# EAGLE design Backplane (EAGLE 7.4.0)

## Sheet 1 of 2
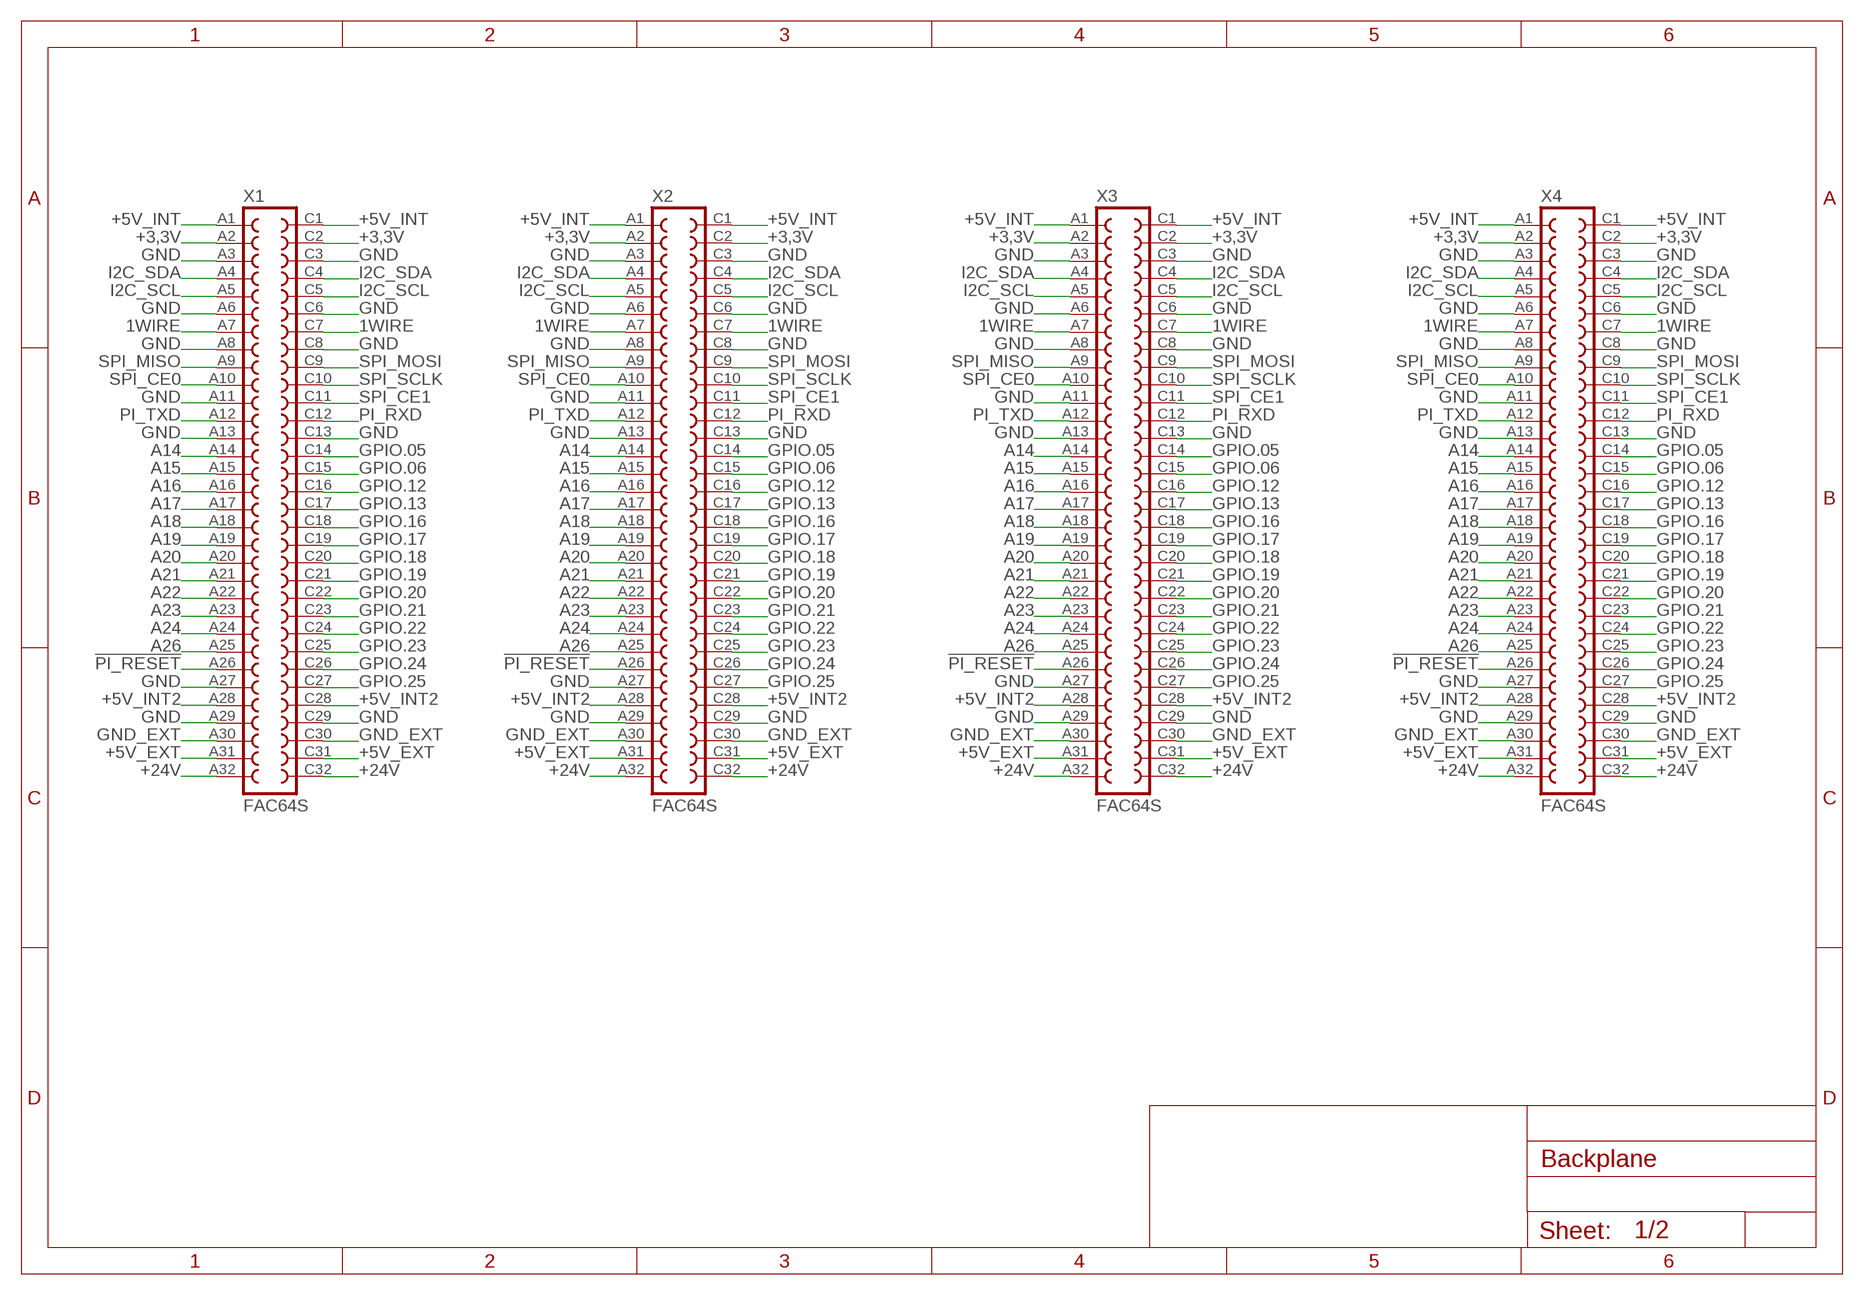
[diagram p0: schematic, sheet 1]

### Parts
X1  FAC64S  [FAC64S]
X2  FAC64S  [FAC64S]
X3  FAC64S  [FAC64S]
X4  FAC64S  [FAC64S]

### Nets
1WIRE: X1.A7 X1.C7 X2.A7 X2.C7 X3.A7 X3.C7 X4.A7 X4.C7 ; also sheet 2
!PI_RESET: X1.A26 X2.A26 X3.A26 X4.A26 ; also sheet 2
+3,3V: X1.A2 X1.C2 X2.A2 X2.C2 X3.A2 X3.C2 X4.A2 X4.C2 ; also sheet 2
+5V_EXT: X1.A31 X1.C31 X2.A31 X2.C31 X3.A31 X3.C31 X4.A31 X4.C31 ; also sheet 2
+5V_INT: X1.A1 X1.C1 X2.A1 X2.C1 X3.A1 X3.C1 X4.A1 X4.C1 ; also sheet 2
+5V_INT2: X1.A28 X1.C28 X2.A28 X2.C28 X3.A28 X3.C28 X4.A28 X4.C28 ; also sheet 2
+24V: X1.A32 X1.C32 X2.A32 X2.C32 X3.A32 X3.C32 X4.A32 X4.C32 ; also sheet 2
A14: X1.A14 X2.A14 X3.A14 X4.A14 ; also sheet 2
A15: X1.A15 X2.A15 X3.A15 X4.A15 ; also sheet 2
A16: X1.A16 X2.A16 X3.A16 X4.A16 ; also sheet 2
A17: X1.A17 X2.A17 X3.A17 X4.A17 ; also sheet 2
A18: X1.A18 X2.A18 X3.A18 X4.A18 ; also sheet 2
A19: X1.A19 X2.A19 X3.A19 X4.A19 ; also sheet 2
A20: X1.A20 X2.A20 X3.A20 X4.A20 ; also sheet 2
A21: X1.A21 X2.A21 X3.A21 X4.A21 ; also sheet 2
A22: X1.A22 X2.A22 X3.A22 X4.A22 ; also sheet 2
A23: X1.A23 X2.A23 X3.A23 X4.A23 ; also sheet 2
A24: X1.A24 X2.A24 X3.A24 X4.A24 ; also sheet 2
A26: X1.A25 X2.A25 X3.A25 X4.A25 ; also sheet 2
GND: X1.A3 X1.A6 X1.A8 X1.A11 X1.A13 X1.A27 X1.A29 X1.C3 X1.C6 X1.C8 X1.C13 X1.C29 X2.A3 X2.A6 X2.A8 X2.A11 X2.A13 X2.A27 X2.A29 X2.C3 X2.C6 X2.C8 X2.C13 X2.C29 X3.A3 X3.A6 X3.A8 X3.A11 X3.A13 X3.A27 X3.A29 X3.C3 X3.C6 X3.C8 X3.C13 X3.C29 X4.A3 X4.A6 X4.A8 X4.A11 X4.A13 X4.A27 X4.A29 X4.C3 X4.C6 X4.C8 X4.C13 X4.C29 ; also sheet 2
GND_EXT: X1.A30 X1.C30 X2.A30 X2.C30 X3.A30 X3.C30 X4.A30 X4.C30 ; also sheet 2
GPIO.05: X1.C14 X2.C14 X3.C14 X4.C14 ; also sheet 2
GPIO.06: X1.C15 X2.C15 X3.C15 X4.C15 ; also sheet 2
GPIO.12: X1.C16 X2.C16 X3.C16 X4.C16 ; also sheet 2
GPIO.13: X1.C17 X2.C17 X3.C17 X4.C17 ; also sheet 2
GPIO.16: X1.C18 X2.C18 X3.C18 X4.C18 ; also sheet 2
GPIO.17: X1.C19 X2.C19 X3.C19 X4.C19 ; also sheet 2
GPIO.18: X1.C20 X2.C20 X3.C20 X4.C20 ; also sheet 2
GPIO.19: X1.C21 X2.C21 X3.C21 X4.C21 ; also sheet 2
GPIO.20: X1.C22 X2.C22 X3.C22 X4.C22 ; also sheet 2
GPIO.21: X1.C23 X2.C23 X3.C23 X4.C23 ; also sheet 2
GPIO.22: X1.C24 X2.C24 X3.C24 X4.C24 ; also sheet 2
GPIO.23: X1.C25 X2.C25 X3.C25 X4.C25 ; also sheet 2
GPIO.24: X1.C26 X2.C26 X3.C26 X4.C26 ; also sheet 2
GPIO.25: X1.C27 X2.C27 X3.C27 X4.C27 ; also sheet 2
I2C_SCL: X1.A5 X1.C5 X2.A5 X2.C5 X3.A5 X3.C5 X4.A5 X4.C5 ; also sheet 2
I2C_SDA: X1.A4 X1.C4 X2.A4 X2.C4 X3.A4 X3.C4 X4.A4 X4.C4 ; also sheet 2
PI_RXD: X1.C12 X2.C12 X3.C12 X4.C12 ; also sheet 2
PI_TXD: X1.A12 X2.A12 X3.A12 X4.A12 ; also sheet 2
SPI_CE0: X1.A10 X2.A10 X3.A10 X4.A10 ; also sheet 2
SPI_CE1: X1.C11 X2.C11 X3.C11 X4.C11 ; also sheet 2
SPI_MISO: X1.A9 X2.A9 X3.A9 X4.A9 ; also sheet 2
SPI_MOSI: X1.C9 X2.C9 X3.C9 X4.C9 ; also sheet 2
SPI_SCLK: X1.C10 X2.C10 X3.C10 X4.C10 ; also sheet 2

## Sheet 2 of 2
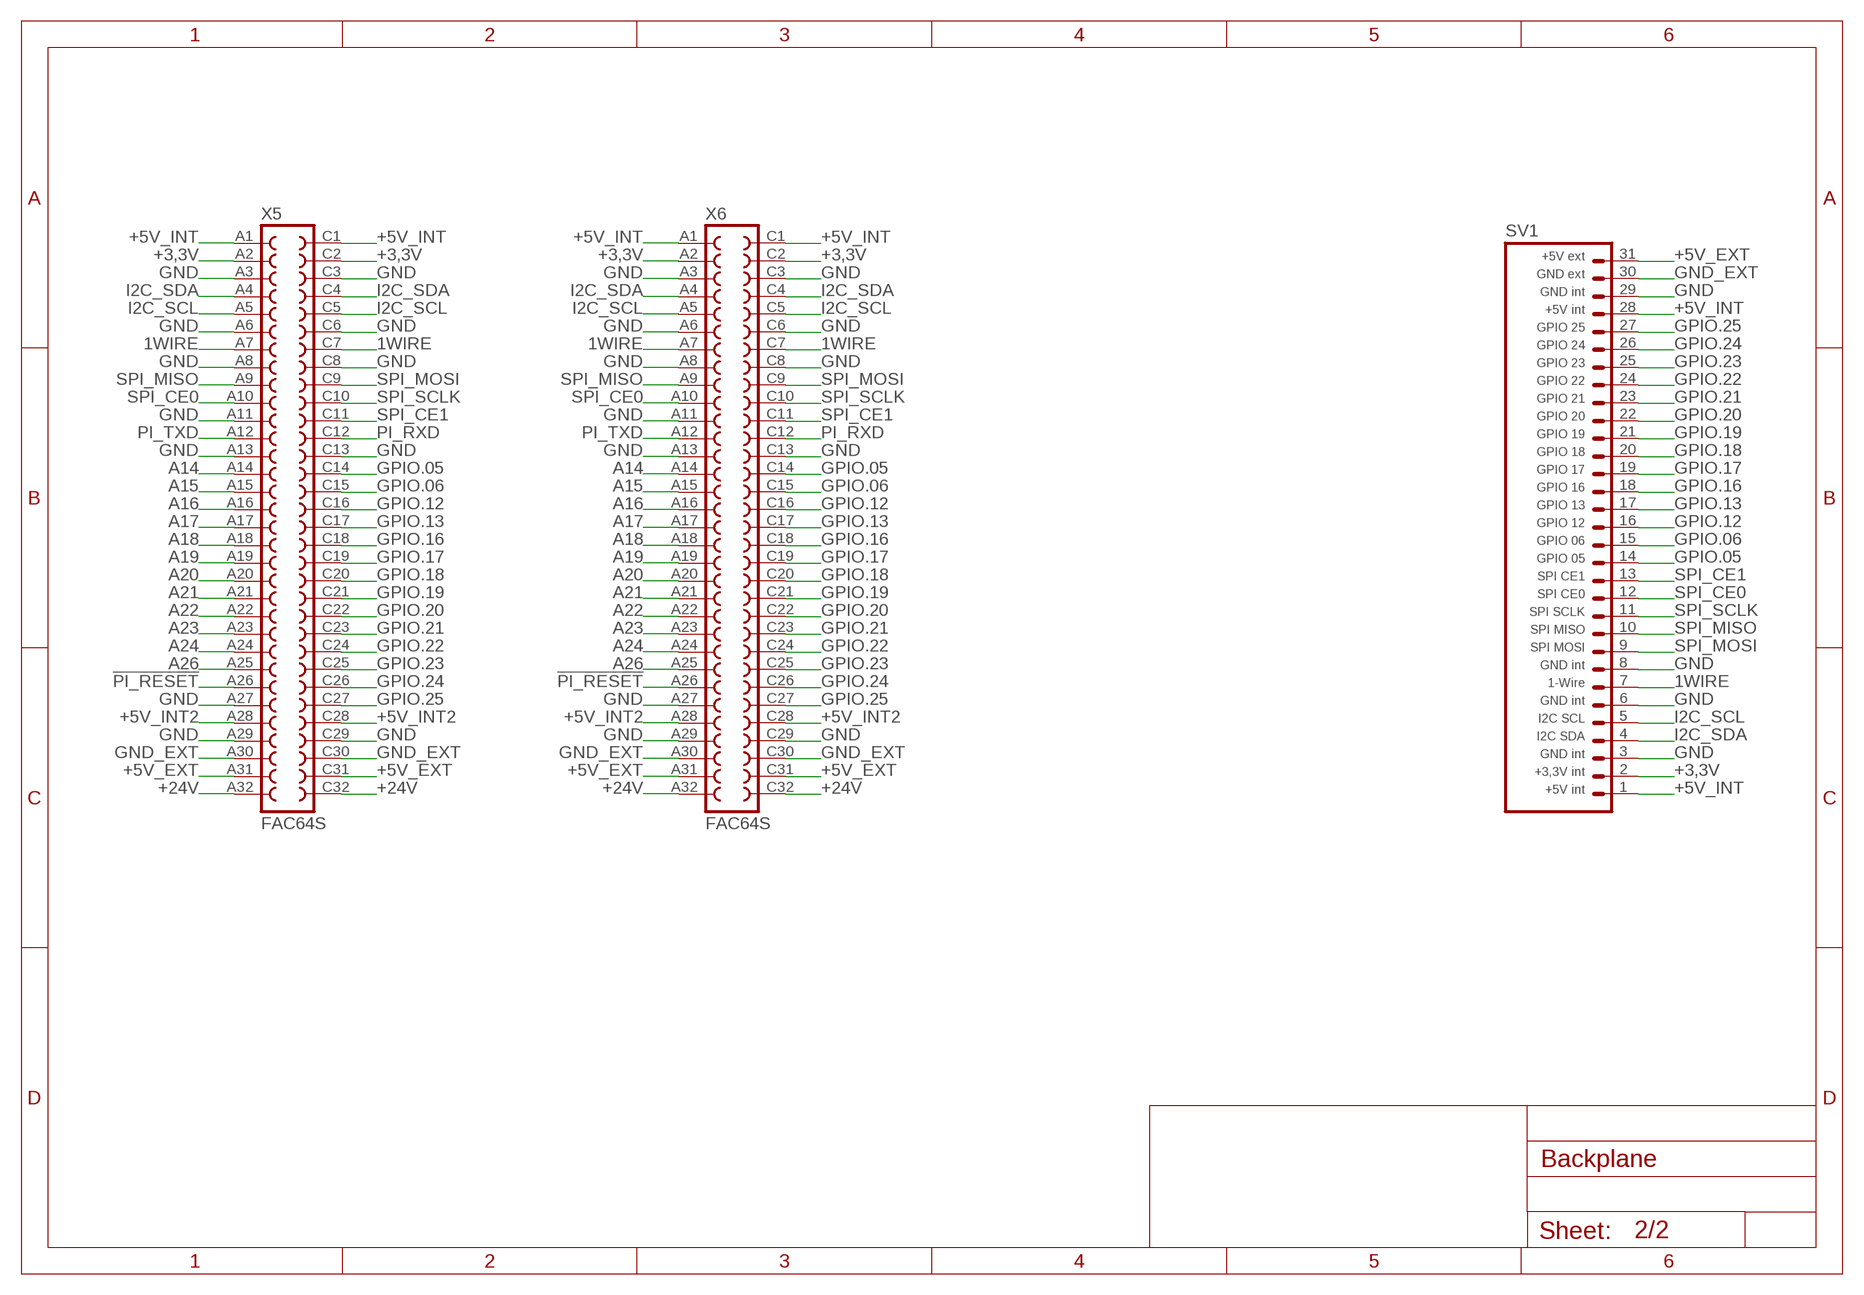
[diagram p1: schematic, sheet 2]

### Parts
SV1  PLATINENVERBINDER-31SMD-BOTTOM  [PLATINENVERBINDER-31-SMD_BOTTOM]
X5  FAC64S  [FAC64S]
X6  FAC64S  [FAC64S]

### Nets
1WIRE: SV1.7 X5.A7 X5.C7 X6.A7 X6.C7 ; also sheet 1
!PI_RESET: X5.A26 X6.A26 ; also sheet 1
+3,3V: SV1.2 X5.A2 X5.C2 X6.A2 X6.C2 ; also sheet 1
+5V_EXT: SV1.31 X5.A31 X5.C31 X6.A31 X6.C31 ; also sheet 1
+5V_INT: SV1.1 SV1.28 X5.A1 X5.C1 X6.A1 X6.C1 ; also sheet 1
+5V_INT2: X5.A28 X5.C28 X6.A28 X6.C28 ; also sheet 1
+24V: X5.A32 X5.C32 X6.A32 X6.C32 ; also sheet 1
A14: X5.A14 X6.A14 ; also sheet 1
A15: X5.A15 X6.A15 ; also sheet 1
A16: X5.A16 X6.A16 ; also sheet 1
A17: X5.A17 X6.A17 ; also sheet 1
A18: X5.A18 X6.A18 ; also sheet 1
A19: X5.A19 X6.A19 ; also sheet 1
A20: X5.A20 X6.A20 ; also sheet 1
A21: X5.A21 X6.A21 ; also sheet 1
A22: X5.A22 X6.A22 ; also sheet 1
A23: X5.A23 X6.A23 ; also sheet 1
A24: X5.A24 X6.A24 ; also sheet 1
A26: X5.A25 X6.A25 ; also sheet 1
GND: SV1.3 SV1.6 SV1.8 SV1.29 X5.A3 X5.A6 X5.A8 X5.A11 X5.A13 X5.A27 X5.A29 X5.C3 X5.C6 X5.C8 X5.C13 X5.C29 X6.A3 X6.A6 X6.A8 X6.A11 X6.A13 X6.A27 X6.A29 X6.C3 X6.C6 X6.C8 X6.C13 X6.C29 ; also sheet 1
GND_EXT: SV1.30 X5.A30 X5.C30 X6.A30 X6.C30 ; also sheet 1
GPIO.05: SV1.14 X5.C14 X6.C14 ; also sheet 1
GPIO.06: SV1.15 X5.C15 X6.C15 ; also sheet 1
GPIO.12: SV1.16 X5.C16 X6.C16 ; also sheet 1
GPIO.13: SV1.17 X5.C17 X6.C17 ; also sheet 1
GPIO.16: SV1.18 X5.C18 X6.C18 ; also sheet 1
GPIO.17: SV1.19 X5.C19 X6.C19 ; also sheet 1
GPIO.18: SV1.20 X5.C20 X6.C20 ; also sheet 1
GPIO.19: SV1.21 X5.C21 X6.C21 ; also sheet 1
GPIO.20: SV1.22 X5.C22 X6.C22 ; also sheet 1
GPIO.21: SV1.23 X5.C23 X6.C23 ; also sheet 1
GPIO.22: SV1.24 X5.C24 X6.C24 ; also sheet 1
GPIO.23: SV1.25 X5.C25 X6.C25 ; also sheet 1
GPIO.24: SV1.26 X5.C26 X6.C26 ; also sheet 1
GPIO.25: SV1.27 X5.C27 X6.C27 ; also sheet 1
I2C_SCL: SV1.5 X5.A5 X5.C5 X6.A5 X6.C5 ; also sheet 1
I2C_SDA: SV1.4 X5.A4 X5.C4 X6.A4 X6.C4 ; also sheet 1
PI_RXD: X5.C12 X6.C12 ; also sheet 1
PI_TXD: X5.A12 X6.A12 ; also sheet 1
SPI_CE0: SV1.12 X5.A10 X6.A10 ; also sheet 1
SPI_CE1: SV1.13 X5.C11 X6.C11 ; also sheet 1
SPI_MISO: SV1.10 X5.A9 X6.A9 ; also sheet 1
SPI_MOSI: SV1.9 X5.C9 X6.C9 ; also sheet 1
SPI_SCLK: SV1.11 X5.C10 X6.C10 ; also sheet 1

## Library data of the parts
SV1 = homepi:PLATINENVERBINDER-31: 31-poliger Steckverbinder
X1-X6 = con-vg:FAC64S: CONNECTOR female, 64 pins, block, type C, rows AC, grid 5.08 mm

## Board
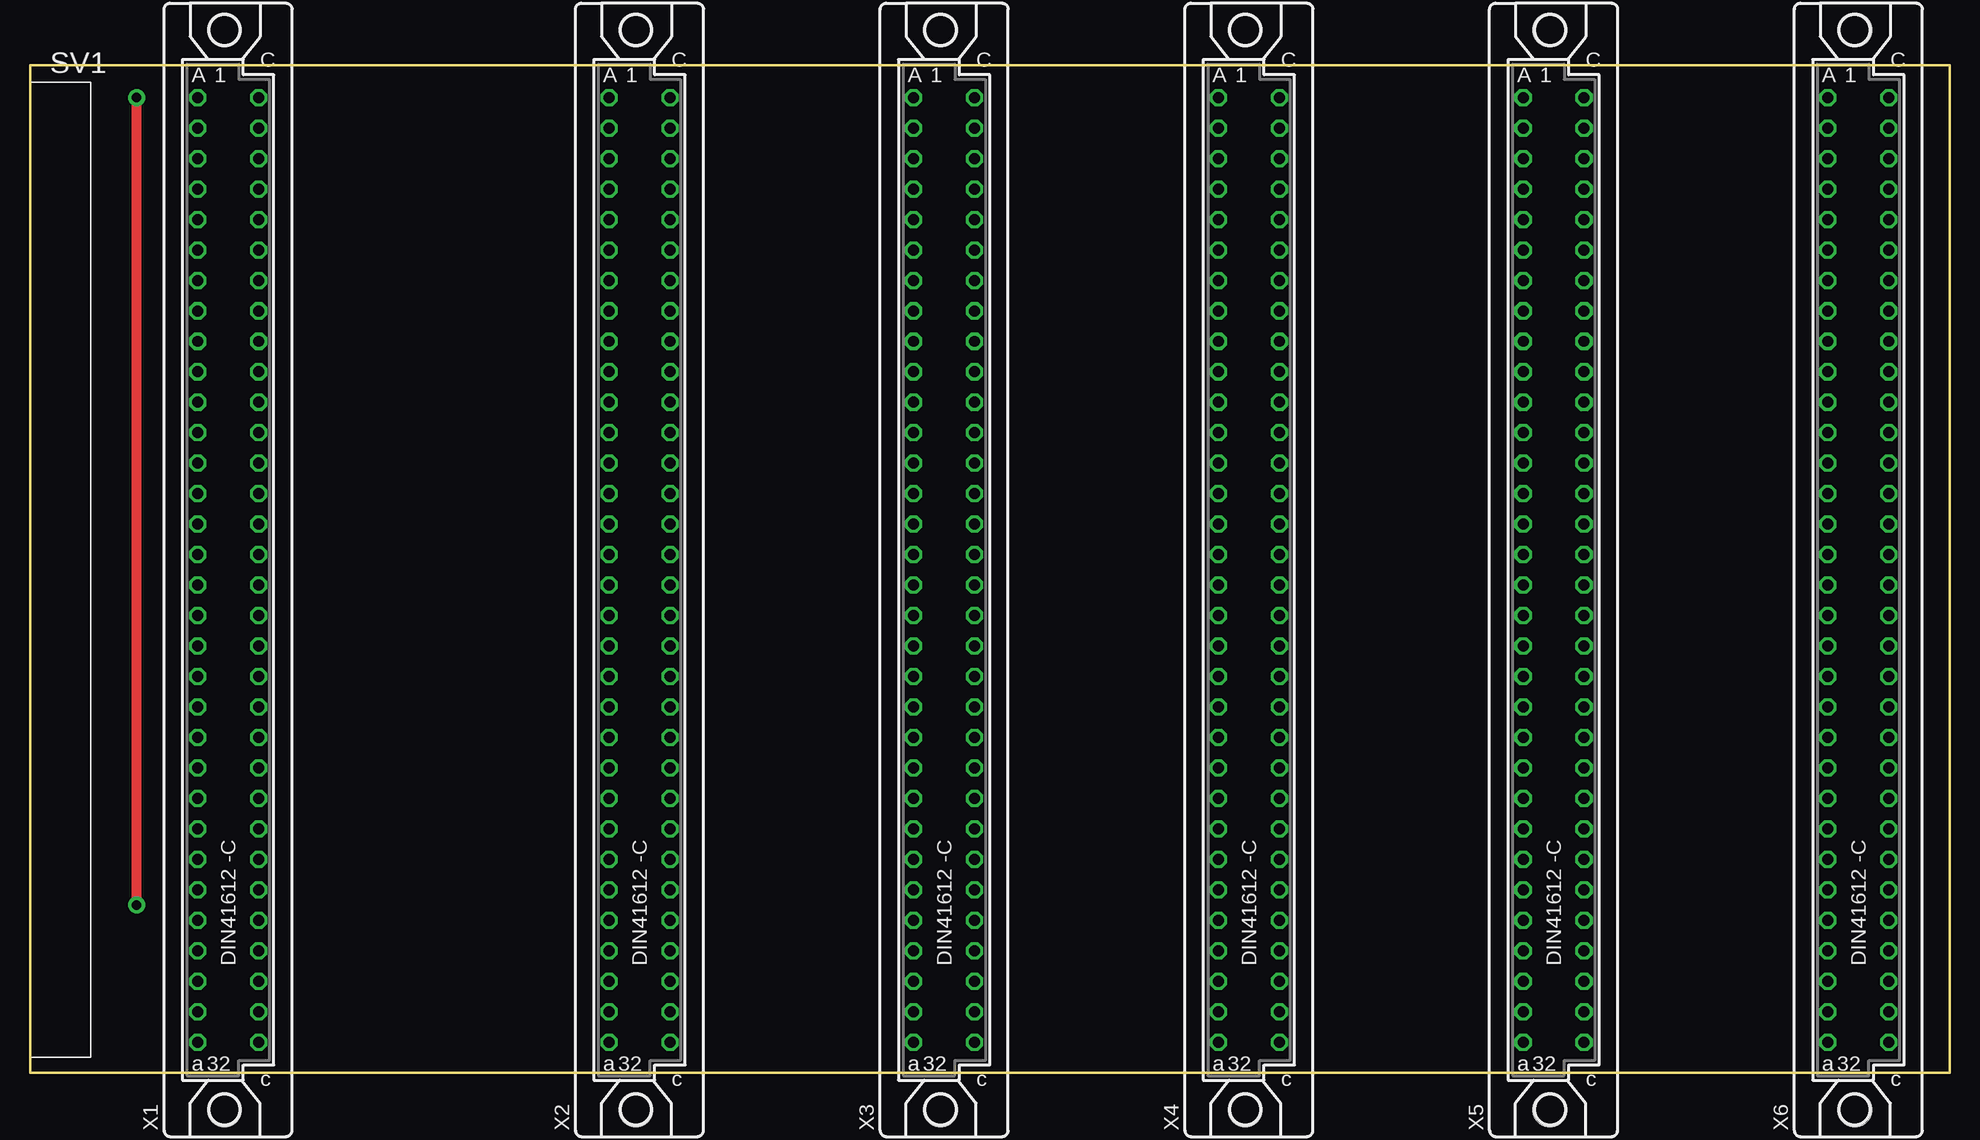
[diagram p2: board, top side]
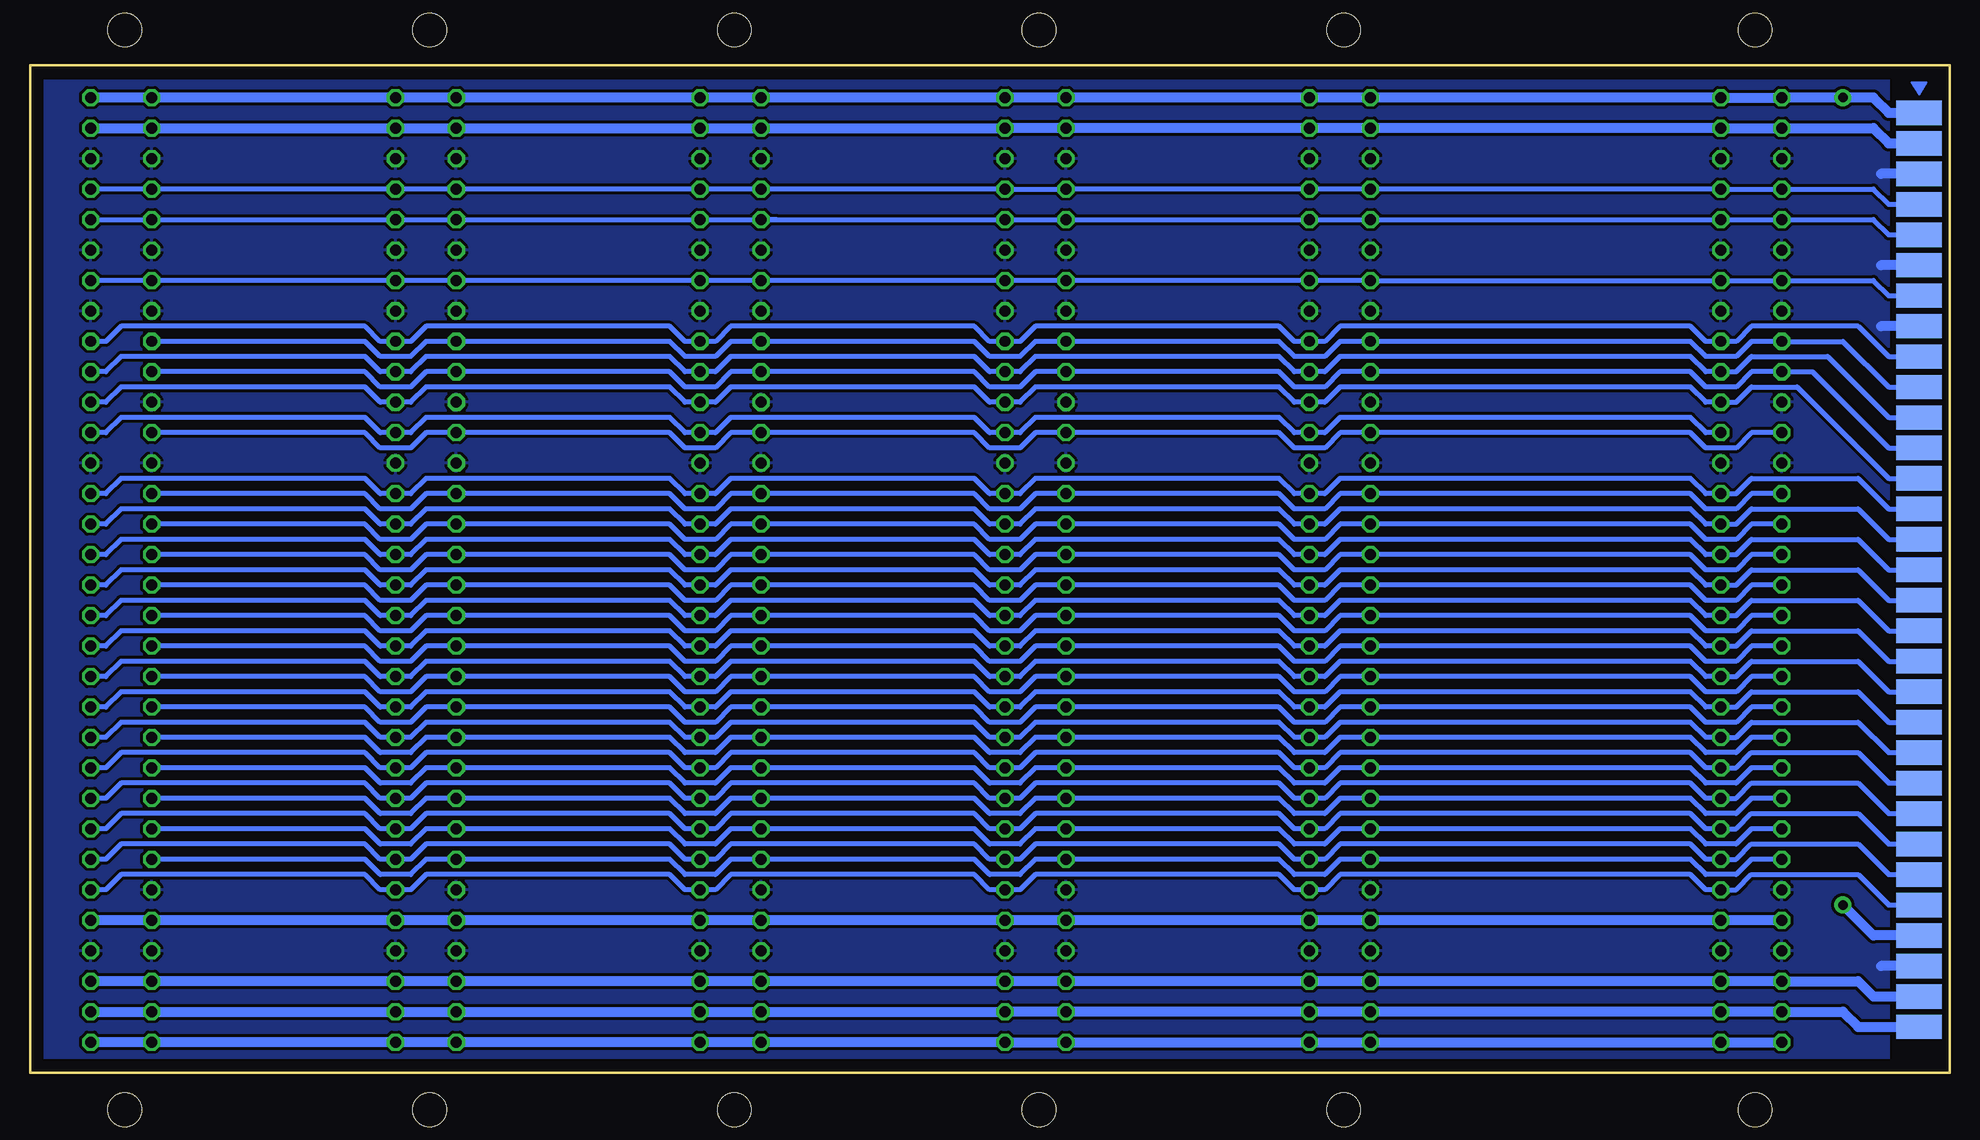
[diagram p3: board, bottom side, seen from below]

Size 160 x 84 mm. Coordinates in mm from the lower left corner, seen from the top.
Outline: 0,0 160,0 160,84 0,84 0,0
Copper layers (1*16): Top 0.035mm / dielectric 1.5mm / Bottom 0.035mm
Design rules "platinenbelichter": minimum track width 10mil, minimum drill 24mil, track to track 10mil, track to pad 10mil, pad to pad 10mil, via to via 10mil, smd to smd 10mil, copper to edge 40mil, drill to drill 8mil, minimum pad ring 10mil, minimum via ring 8mil, stop-mask expansion 10mil, vias tented up to drill 0mil, thermal gap 10mil

### Footprints (pad centres in the part's own frame; a part is rotated, then mirrored left to right if it is on the bottom)
PLATINENVERBINDER-31-SMD_BOTTOM = smd 3.81 x 2.032 bottom: 1 0,-38.1; 2 0,-35.56; 3 0,-33.02; 4 0,-30.48; 5 0,-27.94; 6 0,-25.4; 7 0,-22.86; 8 0,-20.32; 9 0,-17.78; 10 0,-15.24; 11 0,-12.7; 12 0,-10.16; 13 0,-7.62; 14 0,-5.08; 15 0,-2.54; 16 0,0; 17 0,2.54; 18 0,5.08; 19 0,7.62; 20 0,10.16; 21 0,12.7; 22 0,15.24; 23 0,17.78; 24 0,20.32; 25 0,22.86; 26 0,25.4; 27 0,27.94; 28 0,30.48; 29 0,33.02; 30 0,35.56; 31 0,38.1
FAC64S = drill 0.914 octagon: A1 -2.54,39.37; A2 -2.54,36.83; A3 -2.54,34.29; A4 -2.54,31.75; A5 -2.54,29.21; A6 -2.54,26.67; A7 -2.54,24.13; A8 -2.54,21.59; A9 -2.54,19.05; A10 -2.54,16.51; A11 -2.54,13.97; A12 -2.54,11.43; A13 -2.54,8.89; A14 -2.54,6.35; A15 -2.54,3.81; A16 -2.54,1.27; A17 -2.54,-1.27; A18 -2.54,-3.81; A19 -2.54,-6.35; A20 -2.54,-8.89; A21 -2.54,-11.43; A22 -2.54,-13.97; A23 -2.54,-16.51; A24 -2.54,-19.05; A25 -2.54,-21.59; A26 -2.54,-24.13; A27 -2.54,-26.67; A28 -2.54,-29.21; A29 -2.54,-31.75; A30 -2.54,-34.29; A31 -2.54,-36.83; A32 -2.54,-39.37; C1 2.54,39.37; C2 2.54,36.83; C3 2.54,34.29; C4 2.54,31.75; C5 2.54,29.21; C6 2.54,26.67; C7 2.54,24.13; C8 2.54,21.59; C9 2.54,19.05; C10 2.54,16.51; C11 2.54,13.97; C12 2.54,11.43; C13 2.54,8.89; C14 2.54,6.35; C15 2.54,3.81; C16 2.54,1.27; C17 2.54,-1.27; C18 2.54,-3.81; C19 2.54,-6.35; C20 2.54,-8.89; C21 2.54,-11.43; C22 2.54,-13.97; C23 2.54,-16.51; C24 2.54,-19.05; C25 2.54,-21.59; C26 2.54,-24.13; C27 2.54,-26.67; C28 2.54,-29.21; C29 2.54,-31.75; C30 2.54,-34.29; C31 2.54,-36.83; C32 2.54,-39.37 | hole 2.794: -0.305,45.009; -0.305,-45.009

### Placement (x,y rotation side)
SV1  2.54,41.91 180 top
X1  16.51,41.91 0 top
X2  50.8,41.91 0 top
X3  76.2,41.91 0 top
X4  101.6,41.91 0 top
X5  127,41.91 0 top
X6  152.4,41.91 0 top

### Tracks (layer width: path | path; a pad name or v marks a point on that pad's centre or on a via)
1WIRE
  Bottom 0.406: SV1.7 5.08,64.77 6.35,66.04 X1.A7 X1.C7 X2.A7 X2.C7 X3.A7 X3.C7 X4.A7 X4.C7 X5.A7 X5.C7 X6.A7 X6.C7
!PI_RESET
  Bottom 0.406: X1.A26 16.51,17.78 17.78,16.51 20.32,16.51 21.59,17.78 X2.A26 50.8,17.78 52.07,16.51 54.61,16.51 55.88,17.78 X3.A26 76.2,17.78 77.47,16.51 80.01,16.51 81.28,17.78 X4.A26 101.6,17.78 102.87,16.51 105.41,16.51 106.68,17.78 X5.A26 127,17.78 128.27,16.51 130.81,16.51 132.08,17.78 X6.A26
+3,3V
  Bottom 0.813: SV1.2 5.08,77.47 6.35,78.74 X1.A2 X1.C2 X2.A2 X2.C2 X3.A2 X3.C2 X4.A2 X4.C2 X5.A2 X5.C2 X6.A2 X6.C2
+5V_EXT
  Bottom 0.813: SV1.31 7.62,3.81 8.89,5.08 X1.A31 X1.C31 X2.A31 X2.C31 X3.A31 X3.C31 X4.A31 X4.C31 X5.A31 X5.C31 X6.A31 X6.C31
+5V_INT  (via drill 0.8 pad 1.42)
  Top 0.813: v8.89,13.97 v8.89,81.28
  Bottom 0.813: SV1.1 5.08,80.01 6.35,81.28 v8.89,81.28 X1.A1 X1.C1 X2.A1 X2.C1 X3.A1 X3.C1 X4.A1 X4.C1 X5.A1 X5.C1 X6.A1 X6.C1 | SV1.28 6.35,11.43 v8.89,13.97
+5V_INT2
  Bottom 0.813: X1.A28 X1.C28 X2.A28 X2.C28 X3.A28 X3.C28 X4.A28 X4.C28 X5.A28 X5.C28 X6.A28 X6.C28
+24V
  Bottom 0.813: X1.A32 X1.C32 X2.A32 X2.C32 X3.A32 X3.C32 X4.A32 X4.C32 X5.A32 X5.C32 X6.A32 X6.C32
A14
  Bottom 0.406: X1.A14 16.51,48.26 17.78,46.99 20.32,46.99 21.59,48.26 X2.A14 50.8,48.26 52.07,46.99 54.61,46.99 55.88,48.26 X3.A14 76.2,48.26 77.47,46.99 80.01,46.99 81.28,48.26 X4.A14 101.6,48.26 102.87,46.99 105.41,46.99 106.68,48.26 X5.A14 127,48.26 128.27,46.99 130.81,46.99 132.08,48.26 X6.A14
A15
  Bottom 0.406: X1.A15 16.51,45.72 17.78,44.45 20.32,44.45 21.59,45.72 X2.A15 50.8,45.72 52.07,44.45 54.61,44.45 55.88,45.72 X3.A15 76.2,45.72 77.47,44.45 80.01,44.45 81.28,45.72 X4.A15 101.6,45.72 102.87,44.45 105.41,44.45 106.68,45.72 X5.A15 127,45.72 128.27,44.45 130.81,44.45 132.08,45.72 X6.A15
A16
  Bottom 0.406: X1.A16 16.51,43.18 17.78,41.91 20.32,41.91 21.59,43.18 X2.A16 50.8,43.18 52.07,41.91 54.61,41.91 55.88,43.18 X3.A16 76.2,43.18 77.47,41.91 80.01,41.91 81.28,43.18 X4.A16 101.6,43.18 102.87,41.91 105.41,41.91 106.68,43.18 X5.A16 127,43.18 128.27,41.91 130.81,41.91 132.08,43.18 X6.A16
A17
  Bottom 0.406: X1.A17 16.51,40.64 17.78,39.37 20.32,39.37 21.59,40.64 X2.A17 50.8,40.64 52.07,39.37 54.61,39.37 55.88,40.64 X3.A17 76.2,40.64 77.47,39.37 80.01,39.37 81.28,40.64 X4.A17 101.6,40.64 102.87,39.37 105.41,39.37 106.68,40.64 X5.A17 127,40.64 128.27,39.37 130.81,39.37 132.08,40.64 X6.A17
A18
  Bottom 0.406: X1.A18 16.51,38.1 17.78,36.83 20.32,36.83 21.59,38.1 X2.A18 50.8,38.1 52.07,36.83 54.61,36.83 55.88,38.1 X3.A18 76.2,38.1 77.47,36.83 80.01,36.83 81.28,38.1 X4.A18 101.6,38.1 102.87,36.83 105.41,36.83 106.68,38.1 X5.A18 127,38.1 128.27,36.83 130.81,36.83 132.08,38.1 X6.A18
A19
  Bottom 0.406: X1.A19 16.51,35.56 17.78,34.29 20.32,34.29 21.59,35.56 X2.A19 50.8,35.56 52.07,34.29 54.61,34.29 55.88,35.56 X3.A19 76.2,35.56 77.47,34.29 80.01,34.29 81.28,35.56 X4.A19 101.6,35.56 102.87,34.29 105.41,34.29 106.68,35.56 X5.A19 127,35.56 128.27,34.29 130.81,34.29 132.08,35.56 X6.A19
A20
  Bottom 0.406: X1.A20 16.51,33.02 17.78,31.75 20.32,31.75 21.59,33.02 X2.A20 50.8,33.02 52.07,31.75 54.61,31.75 55.88,33.02 X3.A20 76.2,33.02 77.47,31.75 80.01,31.75 81.28,33.02 X4.A20 101.6,33.02 102.87,31.75 105.41,31.75 106.68,33.02 X5.A20 127,33.02 128.27,31.75 130.81,31.75 132.08,33.02 X6.A20
A21
  Bottom 0.406: X1.A21 16.51,30.48 17.78,29.21 20.32,29.21 21.59,30.48 X2.A21 50.8,30.48 52.07,29.21 54.61,29.21 55.88,30.48 X3.A21 76.2,30.48 77.47,29.21 80.01,29.21 81.28,30.48 X4.A21 101.6,30.48 102.87,29.21 105.41,29.21 106.68,30.48 X5.A21 127,30.48 128.27,29.21 130.81,29.21 132.08,30.48 X6.A21
A22
  Bottom 0.406: X1.A22 16.51,27.94 17.78,26.67 20.32,26.67 21.59,27.94 X2.A22 50.8,27.94 52.07,26.67 54.61,26.67 55.88,27.94 X3.A22 76.2,27.94 77.47,26.67 80.01,26.67 81.28,27.94 X4.A22 101.6,27.94 102.87,26.67 105.41,26.67 106.68,27.94 X5.A22 127,27.94 128.27,26.67 130.81,26.67 132.08,27.94 X6.A22
A23
  Bottom 0.406: X1.A23 16.51,25.4 17.78,24.13 20.32,24.13 21.59,25.4 X2.A23 50.8,25.4 52.07,24.13 54.61,24.13 55.88,25.4 X3.A23 76.2,25.4 77.47,24.13 80.01,24.13 81.28,25.4 X4.A23 101.6,25.4 102.87,24.13 105.41,24.13 106.68,25.4 X5.A23 127,25.4 128.27,24.13 130.81,24.13 132.08,25.4 X6.A23
A24
  Bottom 0.406: X1.A24 16.51,22.86 17.78,21.59 20.32,21.59 21.59,22.86 X2.A24 50.8,22.86 52.07,21.59 54.61,21.59 55.88,22.86 X3.A24 76.2,22.86 77.47,21.59 80.01,21.59 81.28,22.86 X4.A24 101.6,22.86 102.87,21.59 105.41,21.59 106.68,22.86 X5.A24 127,22.86 128.27,21.59 130.81,21.59 132.08,22.86 X6.A24
A26
  Bottom 0.406: X1.A25 16.51,20.32 17.78,19.05 20.32,19.05 21.59,20.32 X2.A25 50.8,20.32 52.07,19.05 54.61,19.05 55.88,20.32 X3.A25 76.2,20.32 77.47,19.05 80.01,19.05 81.28,20.32 X4.A25 101.6,20.32 102.87,19.05 105.41,19.05 106.68,20.32 X5.A25 127,20.32 128.27,19.05 130.81,19.05 132.08,20.32 X6.A25
GND
  Bottom 0.813: SV1.3 5.71,74.93 | SV1.8 5.71,62.23 | SV1.6 5.71,67.31 | SV1.29 5.71,8.89
  pour Bottom: 5.08,83.19 159.38,83.19 159.38,0.64 5.08,0.64
GND_EXT
  Bottom 0.813: SV1.30 6.35,6.35 7.62,7.62 X1.A30 X1.C30 X2.A30 X2.C30 X3.A30 X3.C30 X4.A30 X4.C30 X5.A30 X5.C30 X6.A30 X6.C30
GPIO.05
  Bottom 0.406: SV1.14 5.08,46.99 7.62,49.53 16.51,49.53 17.78,48.26 X1.C14 20.32,48.26 21.59,49.53 50.8,49.53 52.07,48.26 X2.C14 54.61,48.26 55.88,49.53 76.2,49.53 77.47,48.26 X3.C14 80.01,48.26 81.28,49.53 101.6,49.53 102.87,48.26 X4.C14 105.41,48.26 106.68,49.53 127,49.53 128.27,48.26 X5.C14 130.81,48.26 132.08,49.53 152.4,49.53 153.67,48.26 X6.C14
GPIO.06
  Bottom 0.406: SV1.15 5.08,44.45 7.62,46.99 16.51,46.99 17.78,45.72 X1.C15 20.32,45.72 21.59,46.99 50.8,46.99 52.07,45.72 X2.C15 54.61,45.72 55.88,46.99 76.2,46.99 77.47,45.72 X3.C15 80.01,45.72 81.28,46.99 101.6,46.99 102.87,45.72 X4.C15 105.41,45.72 106.68,46.99 127,46.99 128.27,45.72 X5.C15 130.81,45.72 132.08,46.99 152.4,46.99 153.67,45.72 X6.C15
GPIO.12
  Bottom 0.406: SV1.16 5.08,41.91 7.62,44.45 16.51,44.45 17.78,43.18 X1.C16 20.32,43.18 21.59,44.45 50.8,44.45 52.07,43.18 X2.C16 54.61,43.18 55.88,44.45 76.2,44.45 77.47,43.18 X3.C16 80.01,43.18 81.28,44.45 101.6,44.45 102.87,43.18 X4.C16 105.41,43.18 106.68,44.45 127,44.45 128.27,43.18 X5.C16 130.81,43.18 132.08,44.45 152.4,44.45 153.67,43.18 X6.C16
GPIO.13
  Bottom 0.406: SV1.17 5.08,39.37 7.62,41.91 16.51,41.91 17.78,40.64 X1.C17 20.32,40.64 21.59,41.91 50.8,41.91 52.07,40.64 X2.C17 54.61,40.64 55.88,41.91 76.2,41.91 77.47,40.64 X3.C17 80.01,40.64 81.28,41.91 101.6,41.91 102.87,40.64 X4.C17 105.41,40.64 106.68,41.91 127,41.91 128.27,40.64 X5.C17 130.81,40.64 132.08,41.91 152.4,41.91 153.67,40.64 X6.C17
GPIO.16
  Bottom 0.406: SV1.18 5.08,36.83 7.62,39.37 16.51,39.37 17.78,38.1 X1.C18 20.32,38.1 21.59,39.37 50.8,39.37 52.07,38.1 X2.C18 54.61,38.1 55.88,39.37 76.2,39.37 77.47,38.1 X3.C18 80.01,38.1 81.28,39.37 101.6,39.37 102.87,38.1 X4.C18 105.41,38.1 106.68,39.37 127,39.37 128.27,38.1 X5.C18 130.81,38.1 132.08,39.37 152.4,39.37 153.67,38.1 X6.C18
GPIO.17
  Bottom 0.406: SV1.19 5.08,34.29 7.62,36.83 16.51,36.83 17.78,35.56 X1.C19 20.32,35.56 21.59,36.83 50.8,36.83 52.07,35.56 X2.C19 54.61,35.56 55.88,36.83 76.2,36.83 77.47,35.56 X3.C19 80.01,35.56 81.28,36.83 101.6,36.83 102.87,35.56 X4.C19 105.41,35.56 106.68,36.83 127,36.83 128.27,35.56 X5.C19 130.81,35.56 132.08,36.83 152.4,36.83 153.67,35.56 X6.C19
GPIO.18
  Bottom 0.406: SV1.20 5.08,31.75 7.62,34.29 16.51,34.29 17.78,33.02 X1.C20 20.32,33.02 21.59,34.29 50.8,34.29 52.07,33.02 X2.C20 54.61,33.02 55.88,34.29 76.2,34.29 77.47,33.02 X3.C20 80.01,33.02 81.28,34.29 101.6,34.29 102.87,33.02 X4.C20 105.41,33.02 106.68,34.29 127,34.29 128.27,33.02 X5.C20 130.81,33.02 132.08,34.29 152.4,34.29 153.67,33.02 X6.C20
GPIO.19
  Bottom 0.406: SV1.21 5.08,29.21 7.62,31.75 16.51,31.75 17.78,30.48 X1.C21 20.32,30.48 21.59,31.75 50.8,31.75 52.07,30.48 X2.C21 54.61,30.48 55.88,31.75 76.2,31.75 77.47,30.48 X3.C21 80.01,30.48 81.28,31.75 101.6,31.75 102.87,30.48 X4.C21 105.41,30.48 106.68,31.75 127,31.75 128.27,30.48 X5.C21 130.81,30.48 132.08,31.75 152.4,31.75 153.67,30.48 X6.C21
GPIO.20
  Bottom 0.406: SV1.22 5.08,26.67 7.62,29.21 16.51,29.21 17.78,27.94 X1.C22 20.32,27.94 21.59,29.21 50.8,29.21 52.07,27.94 X2.C22 54.61,27.94 55.88,29.21 76.2,29.21 77.47,27.94 X3.C22 80.01,27.94 81.28,29.21 101.6,29.21 102.87,27.94 X4.C22 105.41,27.94 106.68,29.21 127,29.21 128.27,27.94 X5.C22 130.81,27.94 132.08,29.21 152.4,29.21 153.67,27.94 X6.C22
GPIO.21
  Bottom 0.406: SV1.23 5.08,24.13 7.62,26.67 16.51,26.67 17.78,25.4 X1.C23 20.32,25.4 21.59,26.67 50.8,26.67 52.07,25.4 X2.C23 54.61,25.4 55.88,26.67 76.2,26.67 77.47,25.4 X3.C23 80.01,25.4 81.28,26.67 101.6,26.67 102.87,25.4 X4.C23 105.41,25.4 106.68,26.67 127,26.67 128.27,25.4 X5.C23 130.81,25.4 132.08,26.67 152.4,26.67 153.67,25.4 X6.C23
GPIO.22
  Bottom 0.406: SV1.24 5.08,21.59 7.62,24.13 16.51,24.13 17.78,22.86 X1.C24 20.32,22.86 21.59,24.13 50.8,24.13 52.07,22.86 X2.C24 54.61,22.86 55.88,24.13 76.2,24.13 77.47,22.86 X3.C24 80.01,22.86 81.28,24.13 101.6,24.13 102.87,22.86 X4.C24 105.41,22.86 106.68,24.13 127,24.13 128.27,22.86 X5.C24 130.81,22.86 132.08,24.13 152.4,24.13 153.67,22.86 X6.C24
GPIO.23
  Bottom 0.406: SV1.25 5.08,19.05 7.62,21.59 16.51,21.59 17.78,20.32 X1.C25 20.32,20.32 21.59,21.59 50.8,21.59 52.07,20.32 X2.C25 54.61,20.32 55.88,21.59 76.2,21.59 77.47,20.32 X3.C25 80.01,20.32 81.28,21.59 101.6,21.59 102.87,20.32 X4.C25 105.41,20.32 106.68,21.59 127,21.59 128.27,20.32 X5.C25 130.81,20.32 132.08,21.59 152.4,21.59 153.67,20.32 X6.C25
GPIO.24
  Bottom 0.406: SV1.26 5.08,16.51 7.62,19.05 16.51,19.05 17.78,17.78 X1.C26 20.32,17.78 21.59,19.05 50.8,19.05 52.07,17.78 X2.C26 54.61,17.78 55.88,19.05 76.2,19.05 77.47,17.78 X3.C26 80.01,17.78 81.28,19.05 101.6,19.05 102.87,17.78 X4.C26 105.41,17.78 106.68,19.05 127,19.05 128.27,17.78 X5.C26 130.81,17.78 132.08,19.05 152.4,19.05 153.67,17.78 X6.C26
GPIO.25
  Bottom 0.406: SV1.27 5.08,13.97 7.62,16.51 16.51,16.51 17.78,15.24 X1.C27 20.32,15.24 21.59,16.51 50.8,16.51 52.07,15.24 X2.C27 54.61,15.24 55.88,16.51 76.2,16.51 77.47,15.24 X3.C27 80.01,15.24 81.28,16.51 101.6,16.51 102.87,15.24 X4.C27 105.41,15.24 106.68,16.51 127,16.51 128.27,15.24 X5.C27 130.81,15.24 132.08,16.51 152.4,16.51 153.67,15.24 X6.C27
I2C_SCL
  Bottom 0.406: SV1.5 5.08,69.85 6.35,71.12 X1.A5 X1.C5 X2.A5 X2.C5 X3.A5 X3.C5 X4.A5 | X6.C5 X6.A5 X5.C5 X5.A5 X4.C5 X4.A5 | 97.79,71.12 X4.A5
I2C_SDA
  Bottom 0.406: SV1.4 5.08,72.39 6.35,73.66 X1.A4 X1.C4 X2.A4 X2.C4 X3.A4 X3.C4 X4.A4 X4.C4 X5.A4 X5.C4 X6.A4 X6.C4
PI_RXD
  Bottom 0.406: X1.C12 20.32,53.34 21.59,54.61 50.8,54.61 52.07,53.34 X2.C12 54.61,53.34 55.88,54.61 76.2,54.61 77.47,53.34 X3.C12 80.01,53.34 81.28,54.61 101.6,54.61 102.87,53.34 X4.C12 105.41,53.34 106.68,54.61 127,54.61 128.27,53.34 X5.C12 130.81,53.34 132.08,54.61 152.4,54.61 153.67,53.34 X6.C12
PI_TXD
  Bottom 0.406: X1.A12 16.51,53.34 17.78,52.07 20.32,52.07 21.59,53.34 X2.A12 50.8,53.34 52.07,52.07 54.61,52.07 55.88,53.34 X3.A12 76.2,53.34 77.47,52.07 80.01,52.07 81.28,53.34 X4.A12 101.6,53.34 102.87,52.07 105.41,52.07 106.68,53.34 X5.A12 127,53.34 128.27,52.07 130.81,52.07 132.08,53.34 X6.A12
SPI_CE0
  Bottom 0.406: SV1.12 5.08,52.07 11.43,58.42 X1.A10 16.51,58.42 17.78,57.15 20.32,57.15 21.59,58.42 X2.A10 50.8,58.42 52.07,57.15 54.61,57.15 55.88,58.42 X3.A10 76.2,58.42 77.47,57.15 80.01,57.15 81.28,58.42 X4.A10 101.6,58.42 102.87,57.15 105.41,57.15 106.68,58.42 X5.A10 127,58.42 128.27,57.15 130.81,57.15 132.08,58.42 X6.A10
SPI_CE1
  Bottom 0.406: SV1.13 5.08,49.53 12.7,57.15 16.51,57.15 17.78,55.88 X1.C11 20.32,55.88 21.59,57.15 50.8,57.15 52.07,55.88 X2.C11 54.61,55.88 55.88,57.15 76.2,57.15 77.47,55.88 X3.C11 80.01,55.88 81.28,57.15 101.6,57.15 102.87,55.88 X4.C11 105.41,55.88 106.68,57.15 127,57.15 128.27,55.88 X5.C11 130.81,55.88 132.08,57.15 152.4,57.15 153.67,55.88 X6.C11
SPI_MISO
  Bottom 0.406: SV1.10 5.08,57.15 8.89,60.96 X1.A9 16.51,60.96 17.78,59.69 20.32,59.69 21.59,60.96 X2.A9 50.8,60.96 52.07,59.69 54.61,59.69 55.88,60.96 X3.A9 76.2,60.96 77.47,59.69 80.01,59.69 81.28,60.96 X4.A9 101.6,60.96 102.87,59.69 105.41,59.69 106.68,60.96 X5.A9 127,60.96 128.27,59.69 130.81,59.69 132.08,60.96 X6.A9
SPI_MOSI
  Bottom 0.406: SV1.9 5.08,59.69 7.62,62.23 16.51,62.23 17.78,60.96 X1.C9 20.32,60.96 21.59,62.23 50.8,62.23 52.07,60.96 X2.C9 54.61,60.96 55.88,62.23 76.2,62.23 77.47,60.96 X3.C9 80.01,60.96 81.28,62.23 101.6,62.23 102.87,60.96 X4.C9 105.41,60.96 106.68,62.23 127,62.23 128.27,60.96 X5.C9 130.81,60.96 132.08,62.23 152.4,62.23 153.67,60.96 X6.C9
SPI_SCLK
  Bottom 0.406: SV1.11 5.08,54.61 10.16,59.69 16.51,59.69 17.78,58.42 X1.C10 20.32,58.42 21.59,59.69 50.8,59.69 52.07,58.42 X2.C10 54.61,58.42 55.88,59.69 76.2,59.69 77.47,58.42 X3.C10 80.01,58.42 81.28,59.69 101.6,59.69 102.87,58.42 X4.C10 105.41,58.42 106.68,59.69 127,59.69 128.27,58.42 X5.C10 130.81,58.42 132.08,59.69 152.4,59.69 153.67,58.42 X6.C10